# EAGLE schematic HGS_Reflector (EAGLE 9.4.2)
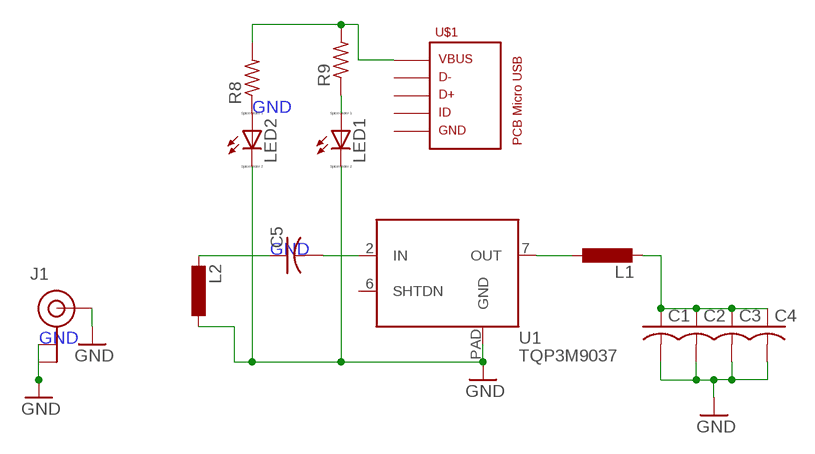
[diagram p0: schematic, sheet 1]

## Parts
C1  C-USC1210  [C1210]
C2  C-USC1210  [C1210]
C3  C-USC1210  [C1210]
C4  C-USC1210  [C1210]
C5  C-USC1210  [C1210]
J1  U.FL  [U.FL]
L1  L-EUL3216C  [L3216C]
L2  L-EUL3216C  [L3216C]
LED1  LED_E  [LED_1206]
LED2  LED_E  [LED_1206]
R8  R-US_R0402  [R0402]
R9  R-US_R0402  [R0402]
U1  TQP3M9037  [DFN8-2X2-WITH-PAD]
U$1  PCB_MICRO_USB_BSS_1  [USB_TYPE_B_SS_1]

## Nets
GND: C1.2 C2.2 C3.2 C4.2 J1.1(GND) J1.2(GND) J1.FEED(SIGNAL) L2.1 LED1.C LED2.C U1.PAD(GND)
N$5: L1.1 U1.7(OUT)
N$6: C1.1 C2.1 C3.1 C4.1 L1.2
N$7: C5.1 L2.2
N$8: C5.2 U1.2(IN)
N$9: LED2.A R8.1
N$10: LED1.A R9.1
N$11: R8.2 R9.2 U$1.1
Unconnected: U1.6(SHTDN) U$1.2 U$1.3 U$1.4 U$1.5

## Library data of the parts
C1-C5 = rcl:C-US: CAPACITOR, American symbol; SPICEPREFIX: C
J1 = SparkFun-Connectors:U.FL: SMD Antenna Connector - U.FL 2mm height, 3.0mm x 3.0mm receptacle size. SparkFun Products: SparkFun WiFi Shield - ESP8266 <https://www.sparkfun.com/products/13287> SparkFun ESP8266 Thing <https://www.sparkfun.com/products/13231> SparkFun MiniGen - Pro Mini Signal Generator Shield <https://www.sparkfun.com/products/11420>; PROD_ID: CONN-09193; SF_ID: WRL-09144
L1 L2 = rcl:L-EU: INDUCTOR, European symbol; SPICEPREFIX: L
LED1 LED2 = eagle-ltspice:LED_E: LED Source: http://www.osram.convergy.de Source: www.luxeon.com Source: www.kingbright.com; SPICEMODEL: NONE; SPICEPREFIX: D; SPICETYPE: diode
R8 R9 = rcl:R-US_: RESISTOR, American symbol; SPICEPREFIX: R
U1 = U-Qorvo-TQP3M9037-LNA:TQP3M9037: Ultra Low Noise, High Linearity LNA 0.7 - 6.0 GHz Operational Bandwidth Source: Datasheet <https://www.qorvo.com/products/p/TQP3M9037>
U$1 = USB_pcb_connectors:PCB_MICRO_USB_B